# Altium project decawave_carrier.PrjPcb
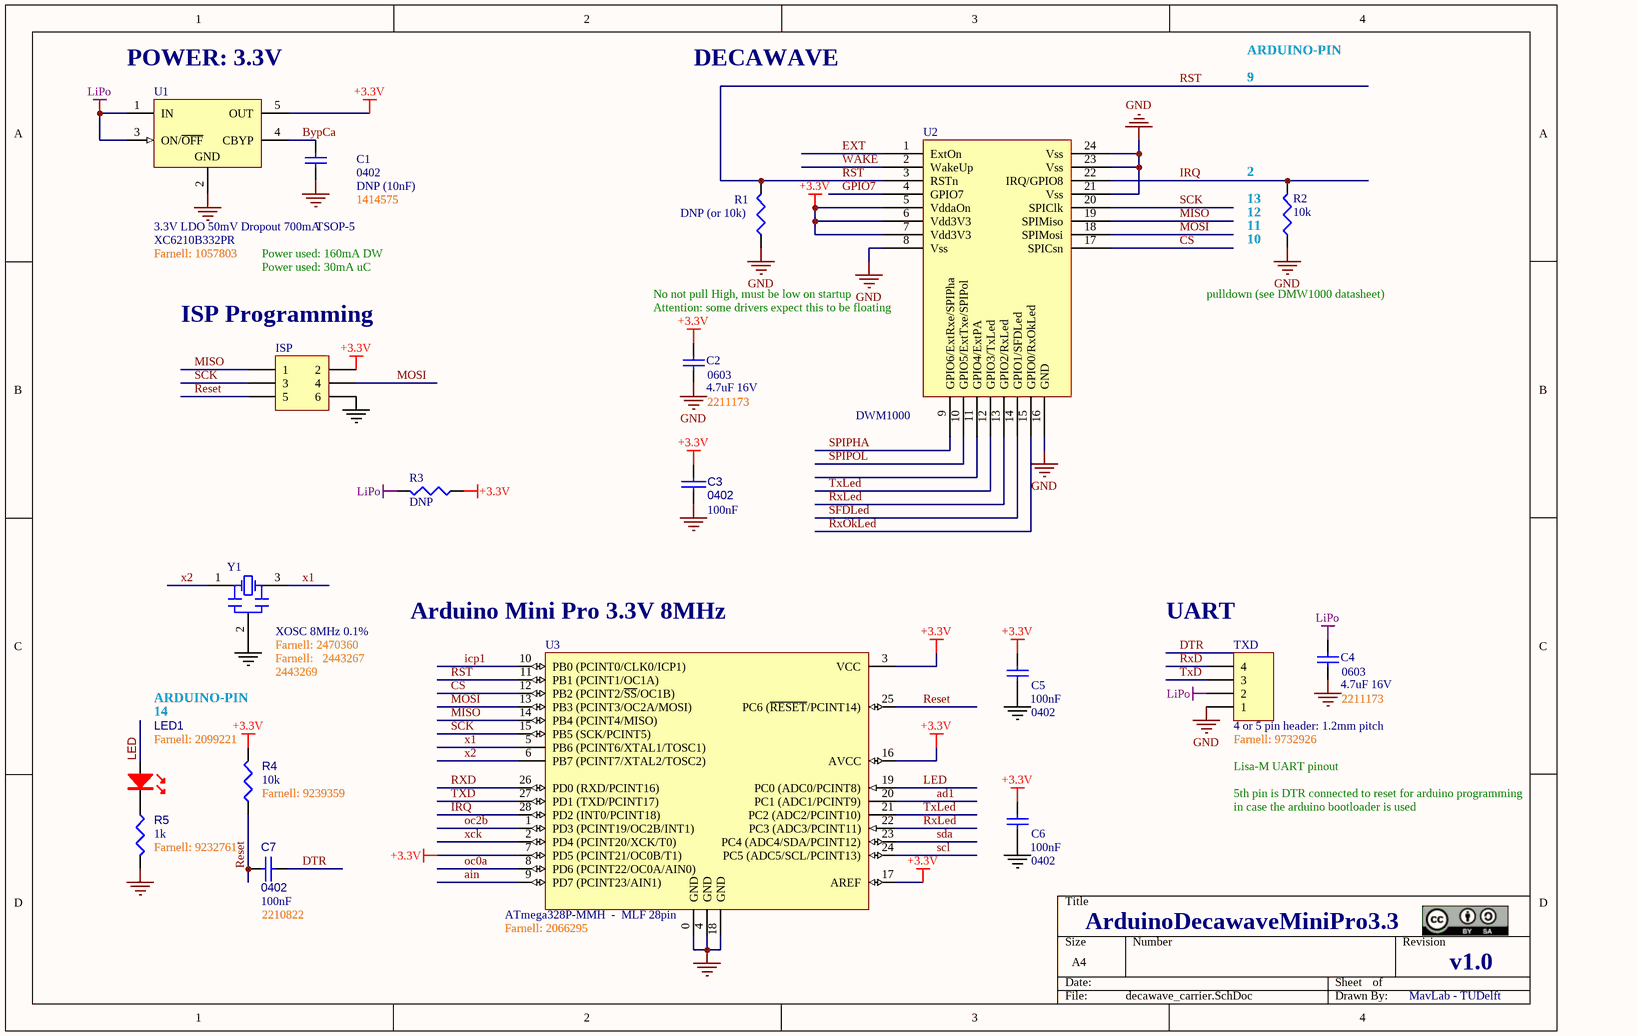
[diagram p0: decawave_carrier.SchDoc]
1 sheet, 19 parts. Net scope: global (net labels, ports and power ports of the same name join across sheets).
Board file: decawave_carrier.PcbDoc

## Sheet decawave_carrier.SchDoc
size A4

### Parts
C1  value DNP (10nF)  Farnell: 1414575  [V0402]  (hidden comment: 0402)  (no BOM)
C2  value 4.7uF 16V  Farnell: 2211173  [V0603]  (hidden comment: 0603)
C3  0402  value 100nF  [V0402]
C4  value 4.7uF 16V  Farnell: 2211173  [V0603]  (hidden comment: 0603)
C5  0402  value 100nF  [V0402]
C6  0402  value 100nF  [V0402]
C7  0402  value 100nF  farnell: 2210822  [V0402]
ISP  Programmer PCB Contacts  [ISP]  (value not drawn)  (no BOM)
LED1  Farnell: 2099221  [KP-1608SURC]  (hidden comment: KP-1608SURC)
R1  value DNP (or 10k)  [V0402RES]  (hidden comment: 0402)  (no BOM)
R2  10k  [V0402RES]
R3  value DNP  [V0402RES]  (hidden comment: 0402)  (no BOM)
R4  Farnell: 9239359  [V0402RES]  (hidden comment: 10k)
R5  Farnell: 9232761  [V0402RES]  (hidden comment: 1k)
TXD  4 or 5 pin header: 1.2mm pitch  Farnell: 9732926  [PICOBLADE_53047-0410]  (no BOM)
U1  3.3V LDO 50mV Dropout 700mA  value XC6210B332PR  Case: TSOP-5  Farnell: 1057803  [SOT-23-OT5_N]
U2  DWM1000  [DWM1000]
U3  ATmega328P-MMH  -  MLF 28pin  Farnell: 2066295  [28M1]
Y1  XOSC 8MHz 0.1%  Farnell: 2470360  [XOSC]

### Nets
+3.3V: C2.2 C3.1 C5.2 C6.2 ISP.2 R3.1 R4.2 U1.5(OUT) U2.5(VddaOn) U2.6(Vdd3V3) U2.7(Vdd3V3) U3.3(VCC) U3.7(PD5_(PCINT21/OC0B/T1)) U3.16(AVCC) U3.17(AREF)
GND: C1.1 C2.1 C3.2 C4.1 C5.1 C6.1 ISP.6 R1.1 R2.1 R5.2 TXD.1 U1.2(GND) U2.8(Vss) U2.16(GND) U2.21(Vss) U2.23(Vss) U2.24(Vss) U3.0(GND) U3.4(GND) U3.18(GND) Y1.2(GND)
LiPo: C4.2 R3.2 TXD.2 U1.1(IN) U1.3(ON/~{OFF})
ad1: U3.20(PC1_(ADC1/PCINT9))
ain: U3.9(PD7_(PCINT23/AIN1))
BypCa: C1.2 U1.4(CBYP)
CS: U2.17(SPICsn) U3.12(PB2_(PCINT2/~{SS}/OC1B))
DTR: C7.2
EXT: U2.1(ExtOn)
GPIO7: U2.4(GPIO7)
icp1: U3.10(PB0_(PCINT0/CLK0/ICP1))
IRQ: R2.2 U2.22(IRQ/GPIO8) U3.28(PD2_(INT0/PCINT18))
LED: LED1.1(A) U3.19(PC0_(ADC0/PCINT8))
MISO: ISP.1 U2.19(SPIMiso) U3.14(PB4_(PCINT4/MISO))
MOSI: ISP.4 U2.18(SPIMosi) U3.13(PB3_(PCINT3/OC2A/MOSI))
oc0a: U3.8(PD6_(PCINT22/OC0A/AIN0))
oc2b: U3.1(PD3_(PCINT19/OC2B/INT1))
Reset: C7.1 ISP.5 R4.1 U3.25(PC6_(~{RESET}/PCINT14))
RST: R1.2 U2.3(RSTn) U3.11(PB1_(PCINT1/OC1A))
RxD: TXD.4 U3.26(PD0_(RXD/PCINT16))
RxLed: U2.13(GPIO2/RxLed) U3.22(PC3_(ADC3/PCINT11))
RxOkLed: U2.15(GPIO0/RxOkLed)
SCK: ISP.3 U2.20(SPIClk) U3.15(PB5_(SCK/PCINT5))
scl: U3.24(PC5_(ADC5/SCL/PCINT13))
sda: U3.23(PC4_(ADC4/SDA/PCINT12))
SFDLed: U2.14(GPIO1/SFDLed)
SPIPHA: U2.9(GPIO6/ExtRxe/SPIPha)
SPIPOL: U2.10(GPIO5/ExtTxe/SPIPol)
TxD: TXD.3 U3.27(PD1_(TXD/PCINT17))
TxLed: U2.12(GPIO3/TxLed) U3.21(PC2_(ADC2/PCINT10))
WAKE: U2.2(WakeUp)
x1: U3.5(PB6_(PCINT6/XTAL1/TOSC1)) Y1.3(OSC2)
x2: U3.6(PB7_(PCINT7/XTAL2/TOSC2)) Y1.1(OSC1)
xck: U3.2(PD4_(PCINT20/XCK/T0))
NetLED1_2: LED1.2(K) R5.1

Not connected (* = marked no-connect by the designer): U2 11(GPIO4/ExtPA)

### Notes on the sheet
- (near U1) POWER: 3.3V
- DECAWAVE
- 9
- ARDUINO-PIN
- (near R2) 2
- (near R2) 13
- (near R2) 12
- (near R2) 11
- (near R2) 10
- Power used: 160mA DW
- Power used: 30mA uC
- (near U2) No not pull High, must be low on startup
- (near U2) Attention: some drivers expect this to be floating
- pulldown (see DMW1000 datasheet)
- (near ISP) ISP Programming
- (near U3) Arduino Mini Pro 3.3V 8MHz
- (near TXD) UART
- 14
- (near Y1) Farnell:   2443267
- 2443269
- Lisa-M UART pinout
- 5th pin is DTR connected to reset for arduino programming
- in case the arduino bootloader is used
- ArduinoDecawaveMiniPro3.3
- v1.0
- MavLab - TUDelft

### Library data of the parts
C1 = Cap: Capacitor; Case: 0402
C2 C4 = K0603_100nF_50V_X7R: Capacitor; Case: 0603
C3 C7 = CAP: Capacitor; Case: 0402
  C3: farnell: 2210822
C5 C6 = Cap: CAPACITOR, 100NF, 16V, X7R; Published: 8-Jun-2000; Revision: July-2002: Re-released for DXP Platform.; Publisher: Altium Limited
ISP = Header 3X2: Surface Contacts for Programming: 2 x 3 pads, no solder paste, top only
LED1 = KP-1608SURC: Led rouge 0603 (GRZ 10/2007); Supplier 1: Digi-Key; Supplier Part Number 1: 754-1123-1-ND
R1-R3 = Res3: Resistor; Case: 0402; farnell: 9241000
  R2: Value: 10k
R4 R5 = RES1
  R4: Value: 10k
  R5: Value: 1k
TXD = Header 4: Header, 4-Pin
U1 = LP2992AIM5-5.0: Micropower 250 mA Low-Noise Ultra Low-Dropout Regulator in SOT-23 and LLP Packages
U2 = DW1000: value: DWM1000
U3 = ATmega88PA_MMH: 8-Bit AVR Microcontroller with 8K Bytes of In-System Programmable Flash Memory; Package Information: Latest Revision: revB, Oct-2001; Code - JEDEC: MS-026-ABA; Published: 17-Sep-2003; Datasheet: Latest Revision: 2486H-AVR-09/02; Package Reference: 32A; Publisher: Altium Limited
Y1 = XOSC: Crystal Oscillator; Published: 8-Jun-2000; LatestRevisionDate: 17-Jul-2002; LatestRevisionNote: Re-released for DXP Platform.; PackageReference: R38; Publisher: Altium Limited